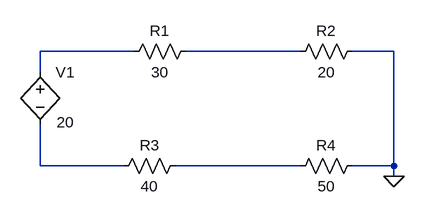
[diagram p0: schematic nikola.asc]
nikola.asc, the LTspice schematic file:
Version 4
SHEET 1 880 680
WIRE 48 80 -96 80
WIRE 304 80 128 80
WIRE 448 80 384 80
WIRE -96 112 -96 80
WIRE -96 256 -96 192
WIRE 32 256 -96 256
WIRE 304 256 112 256
WIRE 448 256 448 80
WIRE 448 256 384 256
WIRE 448 272 448 256
FLAG 448 272 0
SYMBOL res 32 96 R270
WINDOW 0 32 56 VTop 2
WINDOW 3 0 56 VBottom 2
SYMATTR InstName R1
SYMATTR Value 30
SYMBOL res 288 96 R270
WINDOW 0 32 56 VTop 2
WINDOW 3 0 56 VBottom 2
SYMATTR InstName R2
SYMATTR Value 20
SYMBOL res 16 272 R270
WINDOW 0 32 56 VTop 2
WINDOW 3 0 56 VBottom 2
SYMATTR InstName R3
SYMATTR Value 40
SYMBOL res 288 272 R270
WINDOW 0 32 56 VTop 2
WINDOW 3 0 56 VBottom 2
SYMATTR InstName R4
SYMATTR Value 50
SYMBOL bv -96 96 R0
WINDOW 3 25 93 Left 2
SYMATTR InstName V1
SYMATTR Value 20

The netlist it stands for:
* nikola.asc
R1 N001 N002 30
R2 N002 0 20
R3 N003 N004 40
R4 N004 0 50
B§V1 N001 N003 20
.backanno
.end